# Altium schematic sheet inverter 1.SchDoc
size A; SheetNumber: 1; SheetTotal: 1
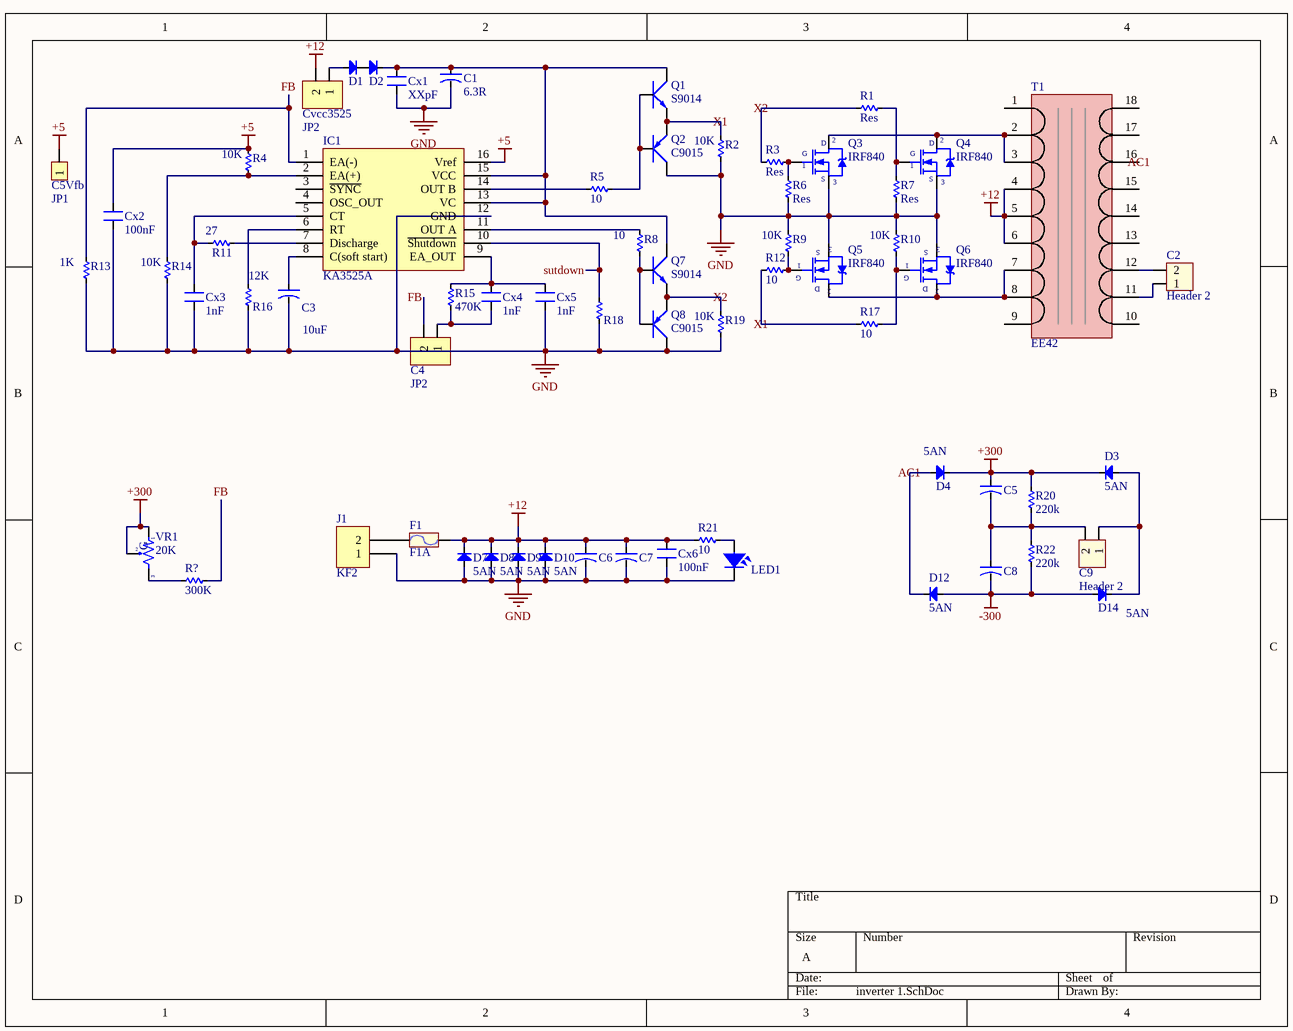
[diagram p0: inverter 1.SchDoc]

## Parts
C1  6.3R  [CA-ALU-6.3R]
C2  Header 2  [HED2]
C3  10uF  [CA-ALU-5L]
C4  JP2  [JP2-D1T]
C5  CN-ALU-DIP  [CA-ALU-16]  (value not drawn)
C5Vfb  JP1  [JP1-D1T]
C6  CN-ALU-DIP  [CA-ALU-16]  (value not drawn)
C7  CN-ALU-DIP  [CA-ALU-16]  (value not drawn)
C8  CN-ALU-DIP  [CA-ALU-16]  (value not drawn)
C9  Header 2  [HED2]
Cvcc3525  JP2  [JP2-D1T]
Cx1  XXpF  [CN2-O]
Cx2  100nF  [CN2-O]
Cx3  1nF  [CN2-O]
Cx4  1nF  [CN2-O]
Cx5  1nF  [CN2-O]
Cx6  100nF  [CN2-O]
D1  Diode  [DIO-1A-SMALL]  (value not drawn)
D2  Diode  [DIO-1A-SMALL]  (value not drawn)
D3  5AN  [DIO-5AN]
D4  5AN  [DIO-5AN]
D7  5AN  [DIO-5AN]
D8  5AN  [DIO-5AN]
D9  5AN  [DIO-5AN]
D10  5AN  [DIO-5AN]
D12  5AN  [DIO-5AN]
D14  5AN  [DIO-5AN]
F1  F1A  [Fuse1]
IC1  KA3525A  [DIP16]
J1  KF2  [KF2-7.62]
LED1  LED  [LED-5-BLUE]  (value not drawn)
Q1  S9014  [TO92-123]
Q2  C9015  [QTO-92]
Q3  IRF840  [TO220H3]
Q4  IRF840  [TO220H3]
Q5  IRF840  [TO220H3]
Q6  IRF840  [TO220H3]
Q7  S9014  [TO92-123]
Q8  C9015  [QTO-92]
R1  Res  [RES-1/4W]
R2  10K  [RES-1/4W-SMALL]
R3  Res  [RES-1/4W]
R4  10K  [RES-1/4W-SMALL]
R5  10  [RES-1/4W-SMALL]
R6  Res  [RES-1/4W]
R7  Res  [RES-1/4W]
R8  10  [RES-1/4W-SMALL]
R9  10K  [RES-1/4W-SMALL]
R10  10K  [RES-1/4W-SMALL]
R11  27  [RES-1/4W-SMALL]
R12  10  [RES-1/4W-SMALL]
R13  1K  [RES-1/4W-SMALL]
R14  10K  [RES-1/4W-SMALL]
R15  470K  [RES-1/4W-SMALL]
R16  12K  [RES-1/4W-SMALL]
R17  10  [RES-1/4W-SMALL]
R18  Res  [RES-1/4W-SMALL]  (value not drawn)
R19  10K  [RES-1/4W-SMALL]
R20  220k  [RES-1/2W]
R21  10  [RES-1/4W-SMALL]
R22  220k  [RES-1/2W]
R?  300K  [RES-1/4W-SMALL]
T1  EE42  [EE42 - ST9x9]
VR1  20K  [VR-S2]

## Nets
+5: C5Vfb.1 Cx2.2 IC1.16(Vref) R4.2
+12: C6.1 C7.1 Cvcc3525.2 Cx6.2 D7.2(K) D8.2(K) D9.2(K) D10.2(K) F1.2 R21.2 T1.4 T1.5 T1.6
+300: C5.1 D3.2(K) D4.2(K) R20.1 VR1.1 VR1.2
-300: C8.2 D12.1(A) D14.1(A) R22.2
GND: C1.2 C3.2 C6.2 C7.2 Cx1.1 Cx2.1 Cx3.1 Cx5.1 Cx6.1 D7.1(A) D8.1(A) D9.1(A) D10.1(A) IC1.12(GND) J1.1 LED1.2 Q2.3(C) Q3.3(S) Q4.3(S) Q5.3(S) Q6.3(S) Q8.3(C) R2.1 R6.2 R7.2 R9.2 R10.2 R13.1 R14.1 R16.2 R18.2 R19.1
AC1: D4.1(A) D12.2(K) T1.16
FB: C4.2 IC1.1(EA(-)) R13.2 R?.1
sutdown: IC1.10(~{Shutdown}) R18.1
X1: Q1.1(E) Q2.1(E) R2.2 R12.2 R17.2
X2: Q7.1(E) Q8.1(E) R1.1 R3.1 R19.2
NetC1_1: C1.1 Cx1.2 D2.2(K) IC1.13(VC) IC1.15(VCC) Q1.3(C) Q7.3(C)
NetC2_1: C2.1 T1.11
NetC2_2: C2.2 T1.12
NetC3_1: C3.1 IC1.8(C(soft_start))
NetC4_1: C4.1 Cx4.1 R15.2
NetC5_2: C5.2 C8.1 C9.2 R20.2 R22.1
NetC9_1: C9.1 D3.1(A) D14.2(K)
NetCvcc3525_1: Cvcc3525.1 D1.1(A)
NetCx3_2: Cx3.2 IC1.5(CT) R11.2
NetCx4_2: Cx4.2 Cx5.2 IC1.9(EA_OUT) R15.1
NetD1_2: D1.2(K) D2.1(A)
NetF1_1: F1.1 J1.2
NetIC1_2: IC1.2(EA(+)) R4.1 R14.2
NetIC1_6: IC1.6(RT) R16.1
NetIC1_7: IC1.7(Discharge) R11.1
NetIC1_11: IC1.11(OUT_A) R8.2
NetIC1_14: IC1.14(OUT_B) R5.2
NetLED1_1: LED1.1 R21.1
NetQ1_2: Q1.2(B) Q2.2(B) R5.1
NetQ3_1: Q3.1(G) R3.2 R6.1
NetQ3_2: Q3.2(D) Q4.2(D) T1.2 T1.3
NetQ4_1: Q4.1(G) R1.2 R7.1
NetQ5_1: Q5.1(G) R9.1 R12.1
NetQ5_2: Q5.2(D) Q6.2(D) T1.7 T1.8
NetQ6_1: Q6.1(G) R10.1 R17.1
NetQ7_2: Q7.2(B) Q8.2(B) R8.1
NetR?_2: R?.2 VR1.3

Not connected (* = marked no-connect by the designer): IC1 3(~{SYNC}) 4(OSC_OUT); T1 1 9 10 13 14 15 17 18

## Notes on the sheet
- (in symbol VR-S) G

## Library data of the parts
C1 C3 C5-C8 = CN-ALU-DIP: Capacitor (Semiconductor SIM Model); Value: 104; LatestRevisionDate: 17-Jul-2002; LatestRevisionNote: Re-released for DXP Platform.; PackageReference: C1206; Publisher: Altium Limited
C2 C9 = Header 2: Header 2 (Green); Value: Header 2
C4 Cvcc3525 = JP2: WR-PHD 2.54 mm Angled Socket Header; Manufacturer: W¨¹rth Elektronik eiSos GmbH; partNo: 613002143121; ComponentLink1 Description: Manufacturer; ComponentLink2 Description: Datasheet; NoPins: 02; Created Date: 29 March 2013; ComponentLink1URL: http://www.we-online.com; ComponentLink2URL: http://katalog.we-online.de/em/datasheet/6130xx143121.pdf; Created by: Karrer Zheng
C5Vfb = JP1: WR-PHD 2.54 mm Angled Socket Header; Manufacturer: W¨¹rth Elektronik eiSos GmbH; partNo: 613002143121; ComponentLink1 Description: Manufacturer; ComponentLink2 Description: Datasheet; NoPins: 02; Created Date: 29 March 2013; ComponentLink1URL: http://www.we-online.com; ComponentLink2URL: http://katalog.we-online.de/em/datasheet/6130xx143121.pdf; Created by: Karrer Zheng
Cx1-Cx6 = CN: Value: 33pF
D1-D4 D7-D10 D12 D14 = Diode: Default Diode; Code - JEDEC: DO-214-AB; Value: 1N5007; Published: 8-Jun-2000; Revision: July-2002: Re-released for DXP Platform.; Publisher: Altium Limited
F1 = Fuse: Designed by: VanDungEvn; Value: Fuse
IC1 = KA3525A: SMPS Controller
J1 = KF2: Manufacturer: Würth Elektronik eiSos GmbH; partNo: 691103110002; ComponentLink1 Description: Manufacturer; ComponentLink2 Description: Datasheet; NoPins: 2; Created Date: 29 October 2013; ComponentLink1URL: http://www.we-online.com; ComponentLink2URL: http://katalog.we-online.de/em/datasheet/6911031100xx.pdf; Created by: Karrer Zheng
LED1 = LED: LED Single colour Green and Red; Value: LED 3 ly Single Colour
Q1 Q7 = S9014: PNP 600mW, EBC; Value: C9014
Q2 Q8 = C9013: PNP 600mW, EBC; Value: C9015
Q3-Q6 = IRF840: MOSFET N - CHANNEL 500V - 0.75 - 8A - TO-220; Value: IRF840
R1-R22 R? = Res: Manufacturer: Generic Components; Class: Passive; SubClass: R; Published: 08/06/2000; Publisher: Altium Hobart Technology Centre
T1 = EE42: Bien ap xung ee42
VR1 = VR-S: Var Resistor; Value: Volume 50k